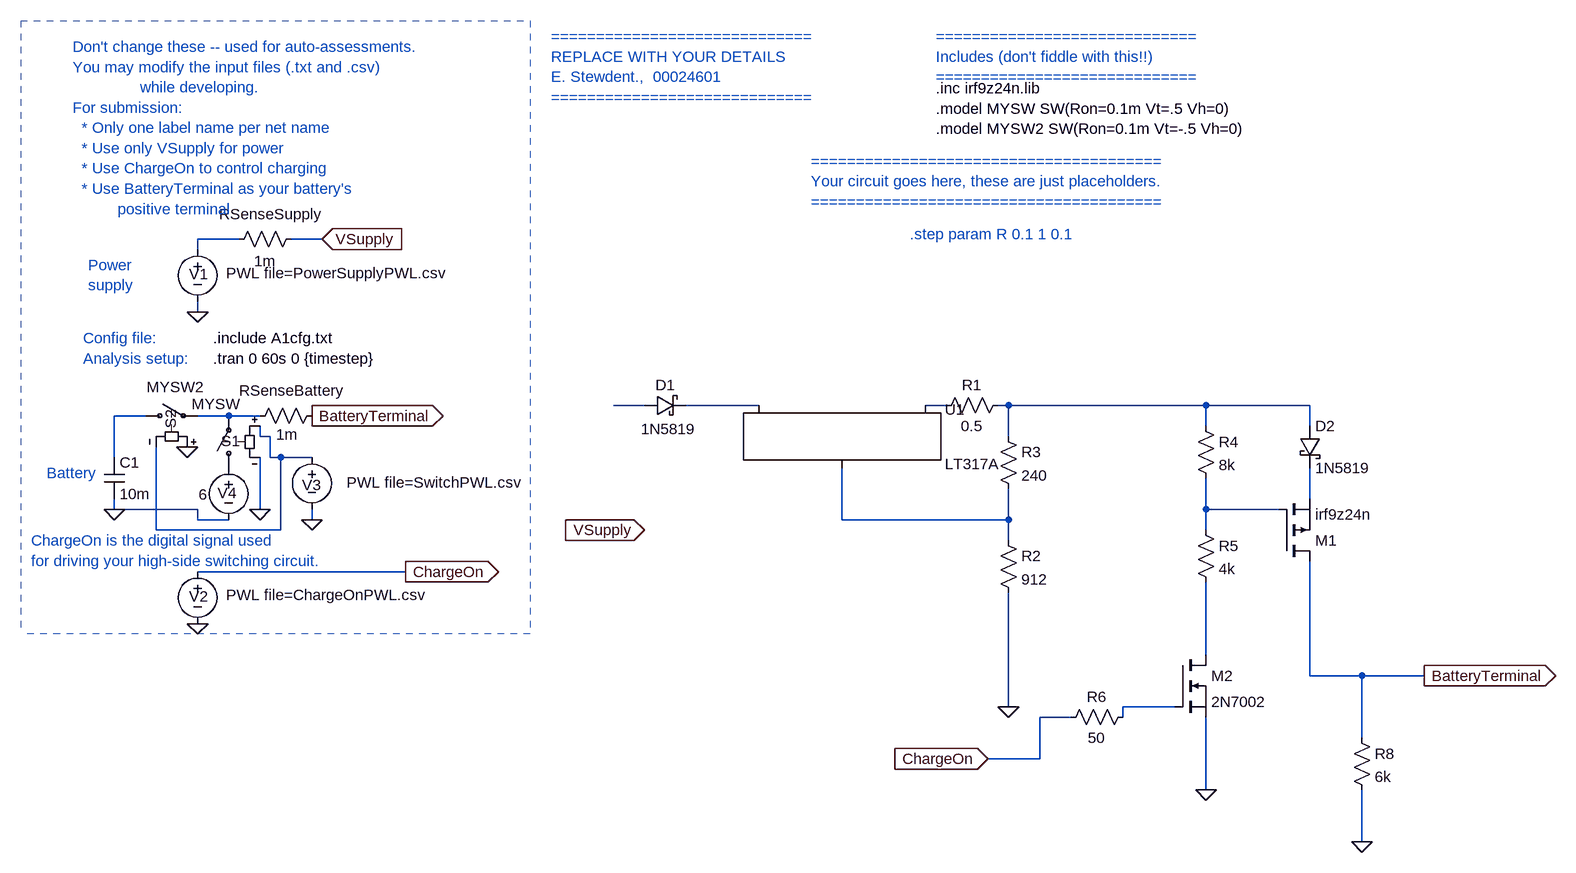
[diagram p0: schematic A2_Design.asc]
A2_Design.asc, the LTspice schematic file:
Version 4
SHEET 1 1824 680
WIRE -2032 -1088 -2096 -1088
WIRE -1904 -1088 -1952 -1088
WIRE -2096 -1072 -2096 -1088
WIRE -2096 -976 -2096 -992
WIRE -1408 -832 -1456 -832
WIRE -1232 -832 -1344 -832
WIRE -944 -832 -976 -832
WIRE -848 -832 -864 -832
WIRE -544 -832 -848 -832
WIRE -384 -832 -544 -832
WIRE -2176 -816 -2224 -816
WIRE -2048 -816 -2096 -816
WIRE -2000 -816 -2048 -816
WIRE -544 -800 -544 -832
WIRE -384 -800 -384 -832
WIRE -2000 -784 -2000 -800
WIRE -1984 -784 -2000 -784
WIRE -848 -784 -848 -832
WIRE -2224 -752 -2224 -816
WIRE -1984 -752 -1984 -784
WIRE -1968 -752 -1984 -752
WIRE -1920 -752 -1968 -752
WIRE -384 -688 -384 -736
WIRE -2224 -672 -2224 -688
WIRE -2096 -672 -2224 -672
WIRE -2000 -672 -2000 -752
WIRE -544 -672 -544 -720
WIRE -432 -672 -544 -672
WIRE -2096 -656 -2096 -672
WIRE -2048 -656 -2096 -656
WIRE -1920 -656 -1920 -672
WIRE -1104 -656 -1104 -736
WIRE -848 -656 -848 -704
WIRE -848 -656 -1104 -656
WIRE -2160 -640 -2160 -768
WIRE -1968 -640 -1968 -752
WIRE -1968 -640 -2160 -640
WIRE -544 -640 -544 -672
WIRE -848 -624 -848 -656
WIRE -1776 -576 -2096 -576
WIRE -544 -448 -544 -560
WIRE -384 -416 -384 -592
WIRE -304 -416 -384 -416
WIRE -208 -416 -304 -416
WIRE -848 -368 -848 -544
WIRE -592 -368 -672 -368
WIRE -752 -352 -800 -352
WIRE -672 -352 -672 -368
WIRE -304 -320 -304 -416
WIRE -800 -288 -800 -352
WIRE -800 -288 -880 -288
WIRE -544 -240 -544 -352
WIRE -304 -160 -304 -240
FLAG -2096 -976 0
FLAG -1904 -1088 VSupply
IOPIN -1904 -1088 In
FLAG -1920 -816 BatteryTerminal
IOPIN -1920 -816 Out
FLAG -1776 -576 ChargeOn
IOPIN -1776 -576 Out
FLAG -2096 -496 0
FLAG -1408 -640 VSupply
IOPIN -1408 -640 In
FLAG -208 -416 BatteryTerminal
IOPIN -208 -416 Out
FLAG -880 -288 ChargeOn
IOPIN -880 -288 In
FLAG -2000 -672 0
FLAG -1920 -656 0
FLAG -2112 -768 0
FLAG -2224 -672 0
FLAG -848 -368 0
FLAG -544 -240 0
FLAG -304 -160 0
DATAFLAG -1440 -640 ""
DATAFLAG -1488 -640 ""
DATAFLAG -976 -288 ""
SYMBOL voltage -2096 -1088 R0
WINDOW 123 0 0 Left 0
WINDOW 39 0 0 Left 0
WINDOW 3 44 52 Left 2
WINDOW 0 -13 54 Left 2
SYMATTR Value PWL file=PowerSupplyPWL.csv
SYMATTR InstName V1
SYMBOL res -1904 -832 R90
WINDOW 0 -7 47 VBottom 2
WINDOW 3 29 54 VTop 2
SYMATTR InstName RSenseBattery
SYMATTR Value 1m
SYMBOL res -1936 -1104 R90
WINDOW 0 -7 47 VBottom 2
WINDOW 3 34 56 VTop 2
SYMATTR InstName RSenseSupply
SYMATTR Value 1m
SYMBOL cap -2240 -752 R0
SYMATTR InstName C1
SYMATTR Value 10m
SYMATTR SpiceLine2 IC=6
SYMBOL voltage -2096 -592 R0
WINDOW 123 0 0 Left 0
WINDOW 39 0 0 Left 0
WINDOW 3 44 52 Left 2
WINDOW 0 -13 54 Left 2
SYMATTR Value PWL file=ChargeOnPWL.csv
SYMATTR InstName V2
SYMBOL PowerProducts\\LT317A -1104 -832 R0
SYMATTR InstName U1
SYMBOL pmos -432 -592 M180
SYMATTR InstName M1
SYMATTR Value irf9z24n
SYMATTR Prefix X
SYMATTR SpiceModel irf9z24n
SYMBOL nmos -592 -448 R0
SYMATTR InstName M2
SYMATTR Value 2N7002
SYMBOL schottky -1408 -816 R270
WINDOW 0 32 32 VTop 2
WINDOW 3 -5 37 VBottom 2
SYMATTR InstName D1
SYMATTR Value 1N5819
SYMATTR Description Diode
SYMATTR Type diode
SYMBOL schottky -400 -800 R0
SYMATTR InstName D2
SYMATTR Value 1N5819
SYMATTR Description Diode
SYMATTR Type diode
SYMBOL sw -2048 -720 R180
WINDOW 0 -18 57 Left 2
WINDOW 3 -17 114 Left 2
SYMATTR InstName S1
SYMATTR Value MYSW
SYMBOL voltage -1920 -768 R0
WINDOW 0 0 43 Top 2
WINDOW 3 188 70 Bottom 2
WINDOW 123 0 0 Left 0
WINDOW 39 0 0 Left 0
SYMATTR InstName V3
SYMATTR Value PWL file=SwitchPWL.csv
SYMBOL sw -2192 -816 R270
WINDOW 0 -20 55 Left 2
WINDOW 3 44 18 VRight 2
SYMATTR InstName S2
SYMATTR Value MYSW2
SYMBOL voltage -2048 -752 R0
WINDOW 0 -17 55 Left 2
WINDOW 3 -46 57 Left 2
WINDOW 123 0 0 Left 0
WINDOW 39 0 0 Left 0
SYMATTR InstName V4
SYMATTR Value 6
SYMBOL res -864 -640 R0
SYMATTR InstName R2
SYMATTR Value 912
SYMBOL res -864 -800 R0
SYMATTR InstName R3
SYMATTR Value 240
SYMBOL res -960 -816 R270
WINDOW 0 32 56 VTop 2
WINDOW 3 0 56 VBottom 2
SYMATTR InstName R1
SYMATTR Value 0.5
SYMBOL res -560 -816 R0
SYMATTR InstName R4
SYMATTR Value 8k
SYMBOL res -560 -656 R0
SYMATTR InstName R5
SYMATTR Value 4k
SYMBOL res -656 -368 R90
WINDOW 0 0 56 VBottom 2
WINDOW 3 32 56 VTop 2
SYMATTR InstName R6
SYMATTR Value 50
SYMBOL res -320 -336 R0
SYMATTR InstName R8
SYMATTR Value 6k
TEXT -2072 -904 Left 2 !.tran 0 60s 0 {timestep}
TEXT -2072 -936 Left 2 !.include A1cfg.txt
TEXT -2288 -1384 Left 2 ;Don't change these -- used for auto-assessments.\nYou may modify the input files (.txt and .csv) \n               while developing.\nFor submission: \n  * Only one label name per net name\n  * Use only VSupply for power\n  * Use ChargeOn to control charging\n  * Use BatteryTerminal as your battery's \n          positive terminal
TEXT -2272 -936 Left 2 ;Config file:
TEXT -2272 -904 Left 2 ;Analysis setup:
TEXT -2328 -728 Left 2 ;Battery
TEXT -2264 -1048 Left 2 ;Power\nsupply
TEXT -1552 -1400 Left 2 ;=============================\nREPLACE WITH YOUR DETAILS\nE. Stewdent.,  00024601\n=============================
TEXT -960 -1320 Left 2 !.inc irf9z24n.lib\n.model MYSW SW(Ron=0.1m Vt=.5 Vh=0)\n.model MYSW2 SW(Ron=0.1m Vt=-.5 Vh=0)
TEXT -2352 -624 Left 2 ;ChargeOn is the digital signal used \nfor driving your high-side switching circuit.
TEXT -960 -1400 Left 2 ;=============================\nIncludes (don't fiddle with this!!)\n=============================
TEXT -1152 -1208 Left 2 ;=======================================\nYour circuit goes here, these are just placeholders.\n=======================================
TEXT -1000 -1096 Left 2 ;.step param R 0.1 1 0.1
LINE Normal -1584 -1424 -1584 -480 2
LINE Normal -2368 -1424 -1584 -1424 2
LINE Normal -1584 -480 -2368 -480 2
LINE Normal -1584 -496 -1584 -496 2
LINE Normal -2368 -1424 -2368 -480 2

The netlist it stands for:
* A2_Design.asc
V1 N001 0 PWL file=PowerSupplyPWL.csv
RSenseBattery BatteryTerminal N007 1m
RSenseSupply VSupply N001 1m
C1 N006 0 10m IC=6
V2 ChargeOn 0 PWL file=ChargeOnPWL.csv
XU1 N011 N004 N003 LT317A
XM1 BatteryTerminal N010 N009 irf9z24n irf9z24n  ; pins D G S
M2 N012 N013 0 0 2N7002
D1 N002 N003 1N5819
D2 N005 N009 1N5819
S1 P001 N007 N008 0 MYSW
V3 N008 0 PWL file=SwitchPWL.csv
S2 N006 N007 0 N008 MYSW2
V4 P001 0 6
R2 N011 0 912
R3 N005 N011 240
R1 N004 N005 0.5
R4 N005 N010 8k
R5 N010 N012 4k
R6 N013 ChargeOn 50
R8 BatteryTerminal 0 6k
.model D D
.lib standard.dio
.model NMOS NMOS
.model PMOS PMOS
.lib standard.mos
.tran 0 60s 0 {timestep}
.include A1cfg.txt
* Don't change these -- used for auto-assessments.
* You may modify the input files (.txt and .csv)
*                while developing.
* For submission:
*   * Only one label name per net name
*   * Use only VSupply for power
*   * Use ChargeOn to control charging
*   * Use BatteryTerminal as your battery's
*           positive terminal
* Config file:
* Analysis setup:
* Battery
* Power
* supply
* =============================
* REPLACE WITH YOUR DETAILS
* E. Stewdent.,  00024601
* =============================
.inc irf9z24n.lib
.model MYSW SW(Ron=0.1m Vt=.5 Vh=0)
.model MYSW2 SW(Ron=0.1m Vt=-.5 Vh=0)
* ChargeOn is the digital signal used
* for driving your high-side switching circuit.
* =============================
* Includes (don't fiddle with this!!)
* =============================
* =======================================
* Your circuit goes here, these are just placeholders.
* =======================================
* .step param R 0.1 1 0.1
.lib LTC.lib
.backanno
.end